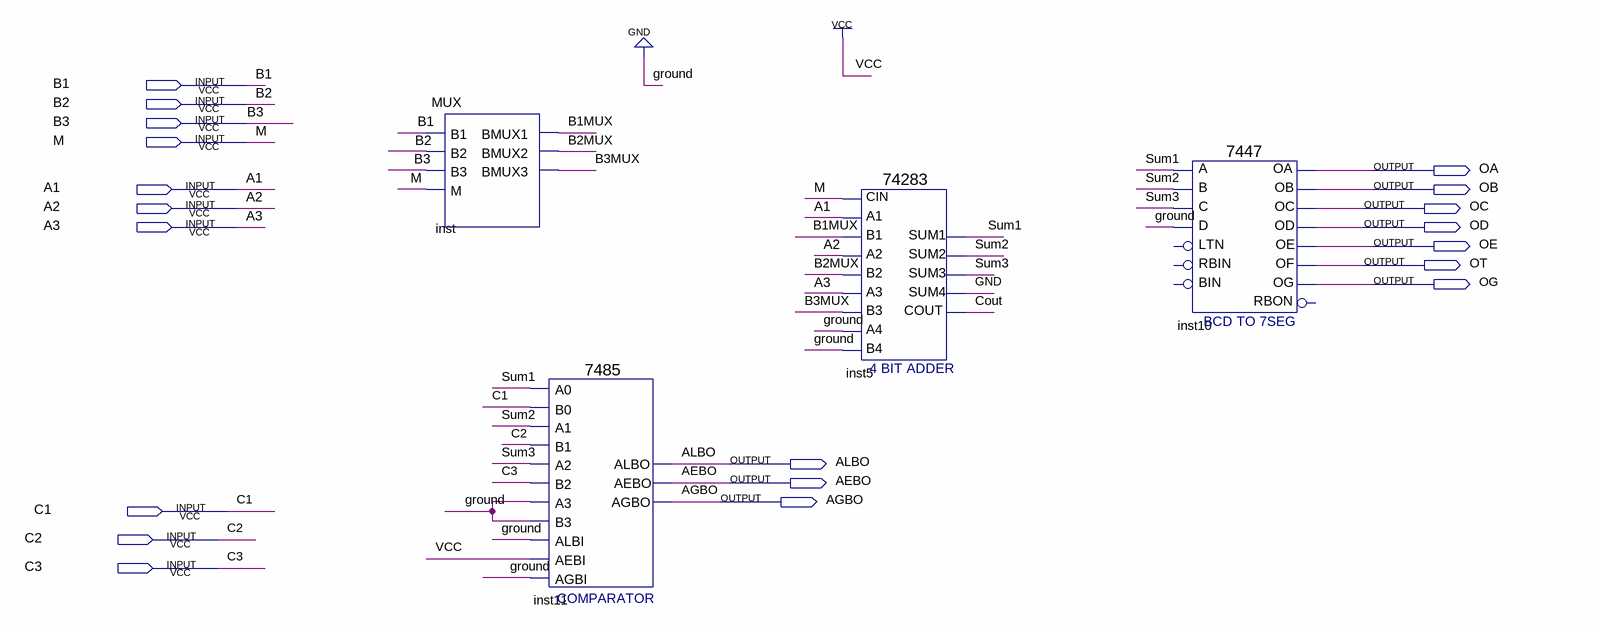
[diagram p0: schematic sheet]
// Quartus schematic combination.bdf as structural Verilog: 4 symbols, 20 pins
module combination (
  input  B1,
  input  B2,
  input  B3,
  input  M,
  input  A1,
  input  A2,
  input  A3,
  input  C1,
  input  C2,
  input  C3,
  output OA,
  output OB,
  output OC,
  output OD,
  output OE,
  output OT,
  output OG,
  output ALBO,
  output AEBO,
  output AGBO
);

  wire B1MUX, B2MUX, B3MUX, Cout, GND, Sum1, Sum2, Sum3;

  MUX inst (.B1(B1), .B2(B2), .B3(B3), .M(M), .BMUX1(B1MUX), .BMUX2(B2MUX), .BMUX3(B3MUX));
  \7485  inst11 (
    .A3(1'b0), .B2(C3), .A2(Sum3), .AEBI(1'b1), .AGBI(1'b0), .ALBI(1'b0), .A0(Sum1), .B0(C1), .B3(1'b0),
    .A1(Sum2), .B1(C2), .ALBO(ALBO), .AGBO(AGBO), .AEBO(AEBO));
  \74283  inst5 (
    .CIN(M), .A1(A1), .A2(A2), .B2(B2MUX), .A3(A3), .A4(1'b0), .B4(1'b0), .B1(B1MUX), .B3(B3MUX), .SUM4(GND),
    .COUT(Cout), .SUM1(Sum1), .SUM2(Sum2), .SUM3(Sum3));
  \7447  inst10 (
    .B(Sum2), .C(Sum3), .D(1'b0), .A(Sum1), .OB(OB), .OC(OC), .OE(OE), .OD(OD), .OF(OT), .OG(OG), .OA(OA));  // open: LTN, RBIN, BIN, RBON
endmodule
